# Altium project Altium-STM32_Example.PrjPcb
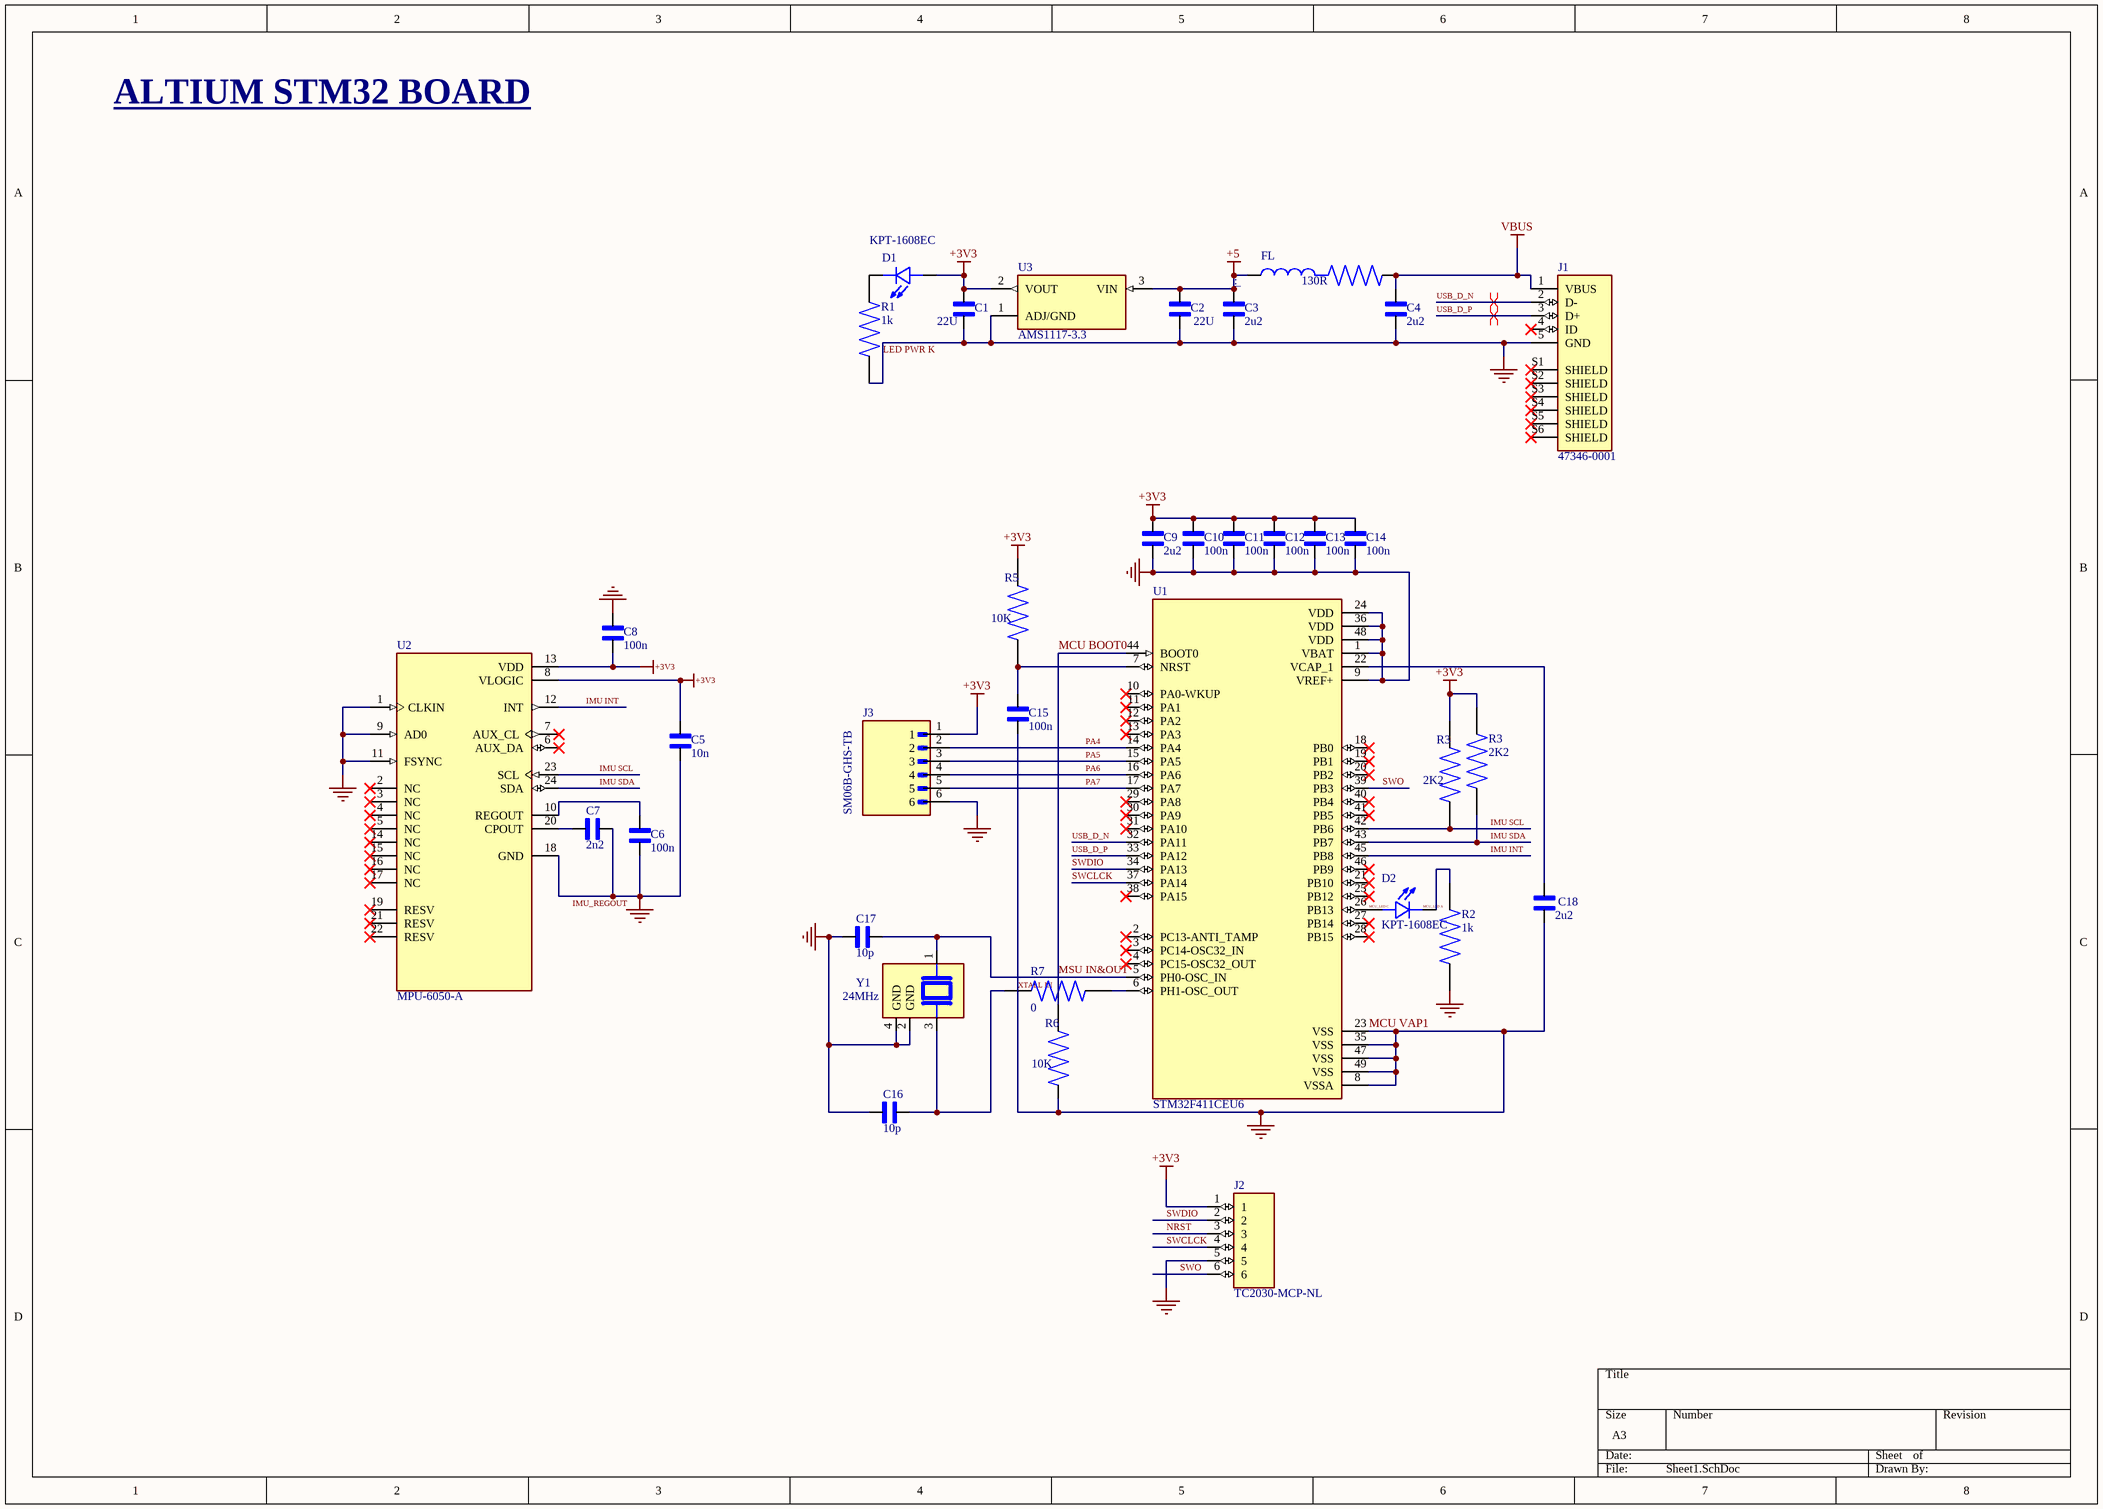
[diagram p0: Sheet1.SchDoc]
1 sheet, 35 parts. Net scope: global (net labels, ports and power ports of the same name join across sheets).
Board file: PCB1.PcbDoc

## Sheet Sheet1.SchDoc
size A3; SheetNumber: 1; SheetTotal: 1

### Parts
(Parts that share a designator on the sheet are numbered #1, #2 ... from top to bottom, then left to right.)
C1  22U  [CAPC2012X88N]
C2  22U  [CAPC2012X88N]
C3  2u2  [CAPC1608X90N]
C4  2u2  [CAPC1608X90N]
C5  10n  [CAPC1005X55N]
C6  100n  [CAPC1005X55N]
C7  2n2  [CAPC1005X55N]
C8  100n  [CAPC1005X55N]
C9  2u2  [CAPC1005X55N]
C10  100n  [CAPC1005X55N]
C11  100n  [CAPC1005X55N]
C12  100n  [CAPC1005X55N]
C13  100n  [CAPC1005X55N]
C14  100n  [CAPC1608X90N]
C15  100n  [CAPC1005X55N]
C16  10p  [CAPC1608X90N]
C17  10p  [CAPC1608X90N]
C18  2u2  [CAPC1608X90N]
D1  KPT-1608EC  [LED_KPT-1608EC]
D2  KPT-1608EC  [LED_KPT-1608EC]
FL  130R  [BEADC1608X95N]
J1  47346-0001  [MOLEX_47346-0001]
J2  TC2030-MCP-NL  [TC2030-MCP-NL]
J3  SM06B-GHS-TB  [JST_SM06B-GHS-TB]
R1  1k  [RES_ERJU02F3600X]
R2  1k  [RES_ERJU02F3600X]
R3#1  2K2  [RES_ERJU02F3600X]
R3#2  2K2  [RES_ERJU02F3600X]
R5  10K  [RES_ERJU02F3600X]
R6  10K  [RES_ERJU02F3600X]
R7  0  [RES_ERJU02F3600X]
U1  STM32F411CEU6  [QFN50P700X700X60-49N]
U2  MPU-6050-A  [QFN50P400X400X95-24N]
U3  AMS1117-3.3  [SOT229P700X180-4N]
Y1  24MHz  [XTAL_TSX-3225_24.0000MF15V-C0]

### Nets
+3V3: C1.1 C5.2 C8.2 C9.2 C10.2 C11.2 C12.2 C13.2 C14.1 D1.A J2.1 J3.1 R3#1.2 R3#2.2 R5.2 U2.8(VLOGIC) U2.13(VDD) U3.2(VOUT)
+5: C2.1 C3.1 FL.1 U3.3(VIN)
LED PWR K: C1.2 C2.2 C3.2 C4.2 C5.1 C6.1 C7.2 C8.1 C9.1 C10.1 C11.1 C12.1 C13.1 C14.2 C15.2 C16.1 C17.1 C18.1 J1.5(GND) J2.5 J3.6 R1.1 R2.1 R6.1 U1.1(VBAT) U1.8(VSSA) U1.9(VREF+) U1.23(VSS) U1.24(VDD) U1.35(VSS) U1.36(VDD) U1.47(VSS) U1.48(VDD) U1.49(VSS) U2.1(CLKIN) U2.9(AD0) U2.11(FSYNC) U2.18(GND) U3.1(ADJ/GND) Y1.2(GND) Y1.4(GND)  [also labelled MCU VAP1, XTALL IN]
VBUS: C4.1 FL.2 J1.1(VBUS)
IMU INT: U1.45(PB8) U2.12(INT)
IMU SCL: R3#2.1 U1.42(PB6) U2.23(SCL)
IMU SDA: R3#1.1 U1.43(PB7) U2.24(SDA)
MCU BOOT0: C17.2 R6.2 U1.5(PH0-OSC_IN) U1.44(BOOT0) Y1.1  [also labelled MSU IN&OUT]
MCU_LED C: D2.A U1.26(PB13)
NRST: J2.3
PA4: J3.2 U1.14(PA4)
PA5: J3.3 U1.15(PA5)
PA6: J3.4 U1.16(PA6)
PA7: J3.5 U1.17(PA7)
SWCLCK: J2.4 U1.37(PA14)
SWDIO: J2.2 U1.34(PA13)
SWO: J2.6 U1.39(PB3)
USB_D_N: J1.2(D-) U1.32(PA11)
USB_D_P: J1.3(D+) U1.33(PA12)
NetC6_2: C6.2 U2.10(REGOUT)
NetC7_1: C7.1 U2.20(CPOUT)
NetC15_1: C15.1 R5.1 U1.7(NRST)
NetC16_2: C16.2 R7.2 Y1.3
NetC18_2: C18.2 U1.22(VCAP_1)
NetD1_C: D1.C R1.2
NetD2_C: D2.C R2.2
NetR7_1: R7.1 U1.6(PH1-OSC_OUT)

Not connected (* = marked no-connect by the designer): J1 4(ID)* S1(SHIELD)* S2(SHIELD)* S3(SHIELD)* S4(SHIELD)* S5(SHIELD)* S6(SHIELD)*; U1 2(PC13-ANTI_TAMP)* 3(PC14-OSC32_IN)* 4(PC15-OSC32_OUT)* 10(PA0-WKUP)* 11(PA1)* 12(PA2)* 13(PA3)* 18(PB0)* 19(PB1)* 20(PB2)* 21(PB10)* 25(PB12)* 27(PB14)* 28(PB15)* 29(PA8)* 30(PA9)* 31(PA10)* 38(PA15)* 40(PB4)* 41(PB5)* 46(PB9)*; U2 2(NC)* 3(NC)* 4(NC)* 5(NC)* 6(AUX_DA)* 7(AUX_CL)* 14(NC)* 15(NC)* 16(NC)* 17(NC)* 19(RESV)* 21(RESV)* 22(RESV)*

### Layout directives
differential pair; differential pair class *DEF-USB: USB_D_N, USB_D_P

### Notes on the sheet
- ALTIUM STM32 BOARD
- Labels drawn without touching a wire or pin: IMU_REGOUT, MCU_LED A

### Library data of the parts
C1 C2 = C0805C475K4PACTU: 4.7 ÂµF Â±10% 16V Ceramic Capacitor X5R 0805 (2012 Metric); MF: KEMET; SnapEDA_Link: https://www.snapeda.com/parts/C0805C475K4PACTU/KEMET/view-part/?ref=snap; Package: 0805 Kemet; Value: *; MP: C0805C475K4PACTU; Check_prices: https://www.snapeda.com/parts/C0805C475K4PACTU/KEMET/view-part/?ref=eda
C3 C4 C14 C16-C18 = C0603C104J4RAC: 0.1 ÂµF Â±5% 16V Ceramic Capacitor X7R 0603 (1608 Metric); MF: KEMET; SnapEDA_Link: https://www.snapeda.com/parts/C0603C104J4RAC/KEMET/view-part/?ref=snap; Package: 603-2 KEMET; Value: *; MP: C0603C104J4RAC; Check_prices: https://www.snapeda.com/parts/C0603C104J4RAC/KEMET/view-part/?ref=eda
C5-C13 C15 = C0402C103K4RAC: 10000 pF Â±10% 16V Ceramic Capacitor X7R 0402 (1005 Metric); MF: KEMET; SnapEDA_Link: https://www.snapeda.com/parts/C0402C103K4RAC/KEMET/view-part/?ref=snap; Package: 402-2 KEMET; Value: *; MP: C0402C103K4RAC; Check_prices: https://www.snapeda.com/parts/C0402C103K4RAC/KEMET/view-part/?ref=eda
D1 D2 = KPT-1608EC: Red Chip LED 1.6x0.8mm; MF: Kingbright; SnapEDA_Link: https://www.snapeda.com/parts/KPT-1608EC/Kingbright/view-part/?ref=snap; Package: Package; Value: *; MP: KPT-1608EC; Check_prices: https://www.snapeda.com/parts/KPT-1608EC/Kingbright/view-part/?ref=eda
FL = BLM18AG471SN1D: 470 Ohms @ 100MHz 1 Ferrite Bead 0603 (1608 Metric) 500mA 350mOhm; MF: Murata Electronics; SnapEDA_Link: https://www.snapeda.com/parts/BLM18AG471SN1D/Murata/view-part/282295/?ref=snap; Value: *; Arrow_Electronics-Purchase-URL: https://snapeda.com/shop?store=Arrow+Electronics&id=282295; Availability: Good; Price: None; Mouser-Purchase-URL: https://snapeda.com/shop?store=Mouser&id=282295; Arrow_Europe-Purchase-URL: https://snapeda.com/shop?store=Arrow+Europe&id=282295; MP: BLM18AG471SN1D; DigiKey-Purchase-URL: https://snapeda.com/shop?store=DigiKey&id=282295; Package: 1608 Murata
J1 = 47346-0001: Conn Data USB Micro B w/Flange SMT Bottom Mnt LF | Molex Incorporated 47346-0001; SnapEDA_Link: https://www.snapeda.com/parts/47346-0001/Molex/view-part/?ref=snap; Package: None; Value: *; MF: Molex; MP: 47346-0001; Check_prices: https://www.snapeda.com/parts/47346-0001/Molex/view-part/?ref=eda
J2 = TC2030-MCP-NL: MPLABÂ® REAL ICE, ICD 3, PICkit 3, PICkit 2 Plug-Of-Nailsâ„¢ Adapter Cable; MF: Tag-Connect LLC; SnapEDA_Link: https://www.snapeda.com/parts/TC2030-MCP-NL/Tag-Connect/view-part/?ref=snap; Package: None; Value: *; MP: TC2030-MCP-NL; Check_prices: https://www.snapeda.com/parts/TC2030-MCP-NL/Tag-Connect/view-part/?ref=eda
J3 = SM06B-GHS-TB: Connector Header Surface Mount, Right Angle 6 position 0.049 (1.25mm); MF: JST Sales; SnapEDA_Link: https://www.snapeda.com/parts/SM06B-GHS-TB/JST/view-part/?ref=snap; Package: None; Value: *; MP: SM06B-GHS-TB; Check_prices: https://www.snapeda.com/parts/SM06B-GHS-TB/JST/view-part/?ref=eda
R1 R2 R3#1 R3#2 R5-R7 = ERJU02F3600X: Price: None; Value: *; MP: ERJU02F3600X; Package: None; Availability: Unavailable
U1 = STM32F411CEU6: High-performance access line, ARM Cortex-M4 core with DSP and FPU, 512 Kbytes Flash, 100 MHz CPU, ART Accelerator; Package: None; Availability: Unavailable; Value: *; MP: STM32F411CEU6; Price: None
U2 = MPU-6050-A: MF: TDK InvenSense; SnapEDA_Link: https://www.snapeda.com/parts/MPU-6050-A/InvenSense/view-part/?ref=snap; Package: None; Value: *; MP: MPU-6050-A; Check_prices: https://www.snapeda.com/parts/MPU-6050-A/InvenSense/view-part/?ref=eda
U3 = AMS1117-3.3: Linear Voltage Regulator IC Positive Fixed 1 Output 1A SOT-223-3L; MF: UMW; SnapEDA_Link: https://www.snapeda.com/parts/AMS1117-3.3/UMW/view-part/?ref=snap; Package: SOT-223-3L UMW; Value: *; MP: AMS1117-3.3; Check_prices: https://www.snapeda.com/parts/AMS1117-3.3/UMW/view-part/?ref=eda
Y1 = TSX-3225_24.0000MF15V-C0: 24 MHz Â±10ppm Crystal 18pF 40 Ohms 4-SMD, No Lead; MF: EPSON; MP: TSX-3225 24.0000MF15V-C0; Check_prices: https://www.snapeda.com/parts/TSX-3225%2024.0000MF15V-C0/EPSON/view-part/?ref=eda; SnapEDA_Link: https://www.snapeda.com/parts/TSX-3225%2024.0000MF15V-C0/EPSON/view-part/?ref=snap; Digi-Key_Part_Number: SER4209TR-ND; Value: *; Purchase-URL: https://pricing.snapeda.com/search/part/TSX-3225 24.0000MF15V-C0/?ref=eda; Package: NON STANDARD-4 EPSON